# Altium schematic sheet main.SchDoc
size A; SheetNumber: 1; SheetTotal: 5
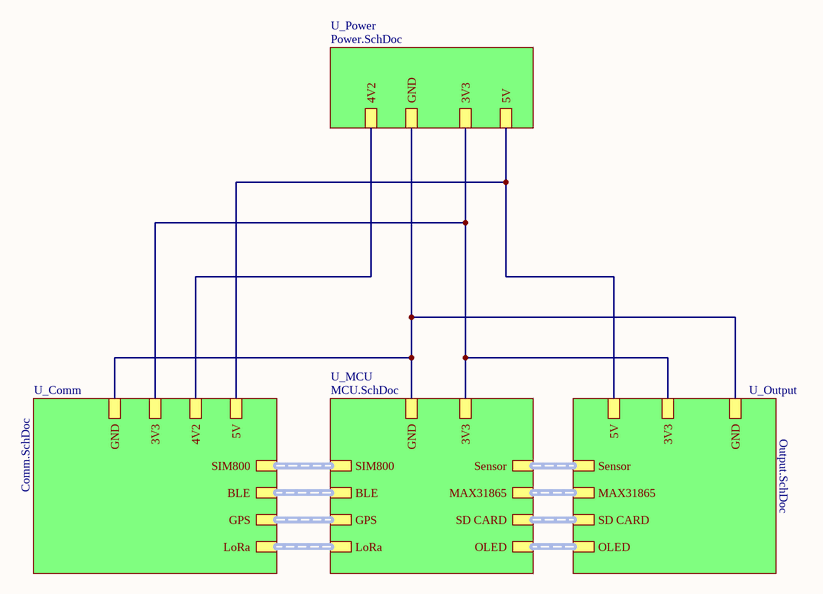
[diagram p0: main.SchDoc]

## Sub-sheets
U_Comm = Comm.SchDoc: SIM800 (harness SIM800), BLE (harness BLE), GPS (harness GPS), LoRa (harness LORA), 5V, 4V2, 3V3, GND
U_MCU = MCU.SchDoc: SIM800 (harness SIM800), BLE (harness BLE), GPS (harness GPS), LoRa (harness LORA), Sensor (harness Sensor), MAX31865 (harness MAX31865), SD CARD (harness SD CARD), OLED (harness OLED), 3V3, GND
U_Output = Output.SchDoc: Sensor (harness Sensor), MAX31865 (harness MAX31865), SD CARD (harness SD CARD), OLED (harness OLED), 5V, 3V3, GND
U_Power = Power.SchDoc: 5V, 4V2, 3V3, GND

## Nets
(unnamed): sheet U_Comm/5V, sheet U_Output/5V, sheet U_Power/5V
(unnamed): sheet U_Comm/4V2, sheet U_Power/4V2
(unnamed): sheet U_Comm/3V3, sheet U_MCU/3V3, sheet U_Output/3V3, sheet U_Power/3V3
(unnamed): sheet U_Comm/GND, sheet U_MCU/GND, sheet U_Output/GND, sheet U_Power/GND

## Buses and harness runs
harness sheet U_Comm/BLE = sheet U_MCU/BLE
harness sheet U_Comm/GPS = sheet U_MCU/GPS
harness sheet U_Comm/LoRa = sheet U_MCU/LoRa
harness sheet U_Comm/SIM800 = sheet U_MCU/SIM800
harness sheet U_MCU/MAX31865 = sheet U_Output/MAX31865
harness sheet U_MCU/OLED = sheet U_Output/OLED
harness sheet U_MCU/SD CARD = sheet U_Output/SD CARD
harness sheet U_MCU/Sensor = sheet U_Output/Sensor